# EAGLE design Adafruit Infrared IR Remote Receiver (EAGLE 9.6.2)
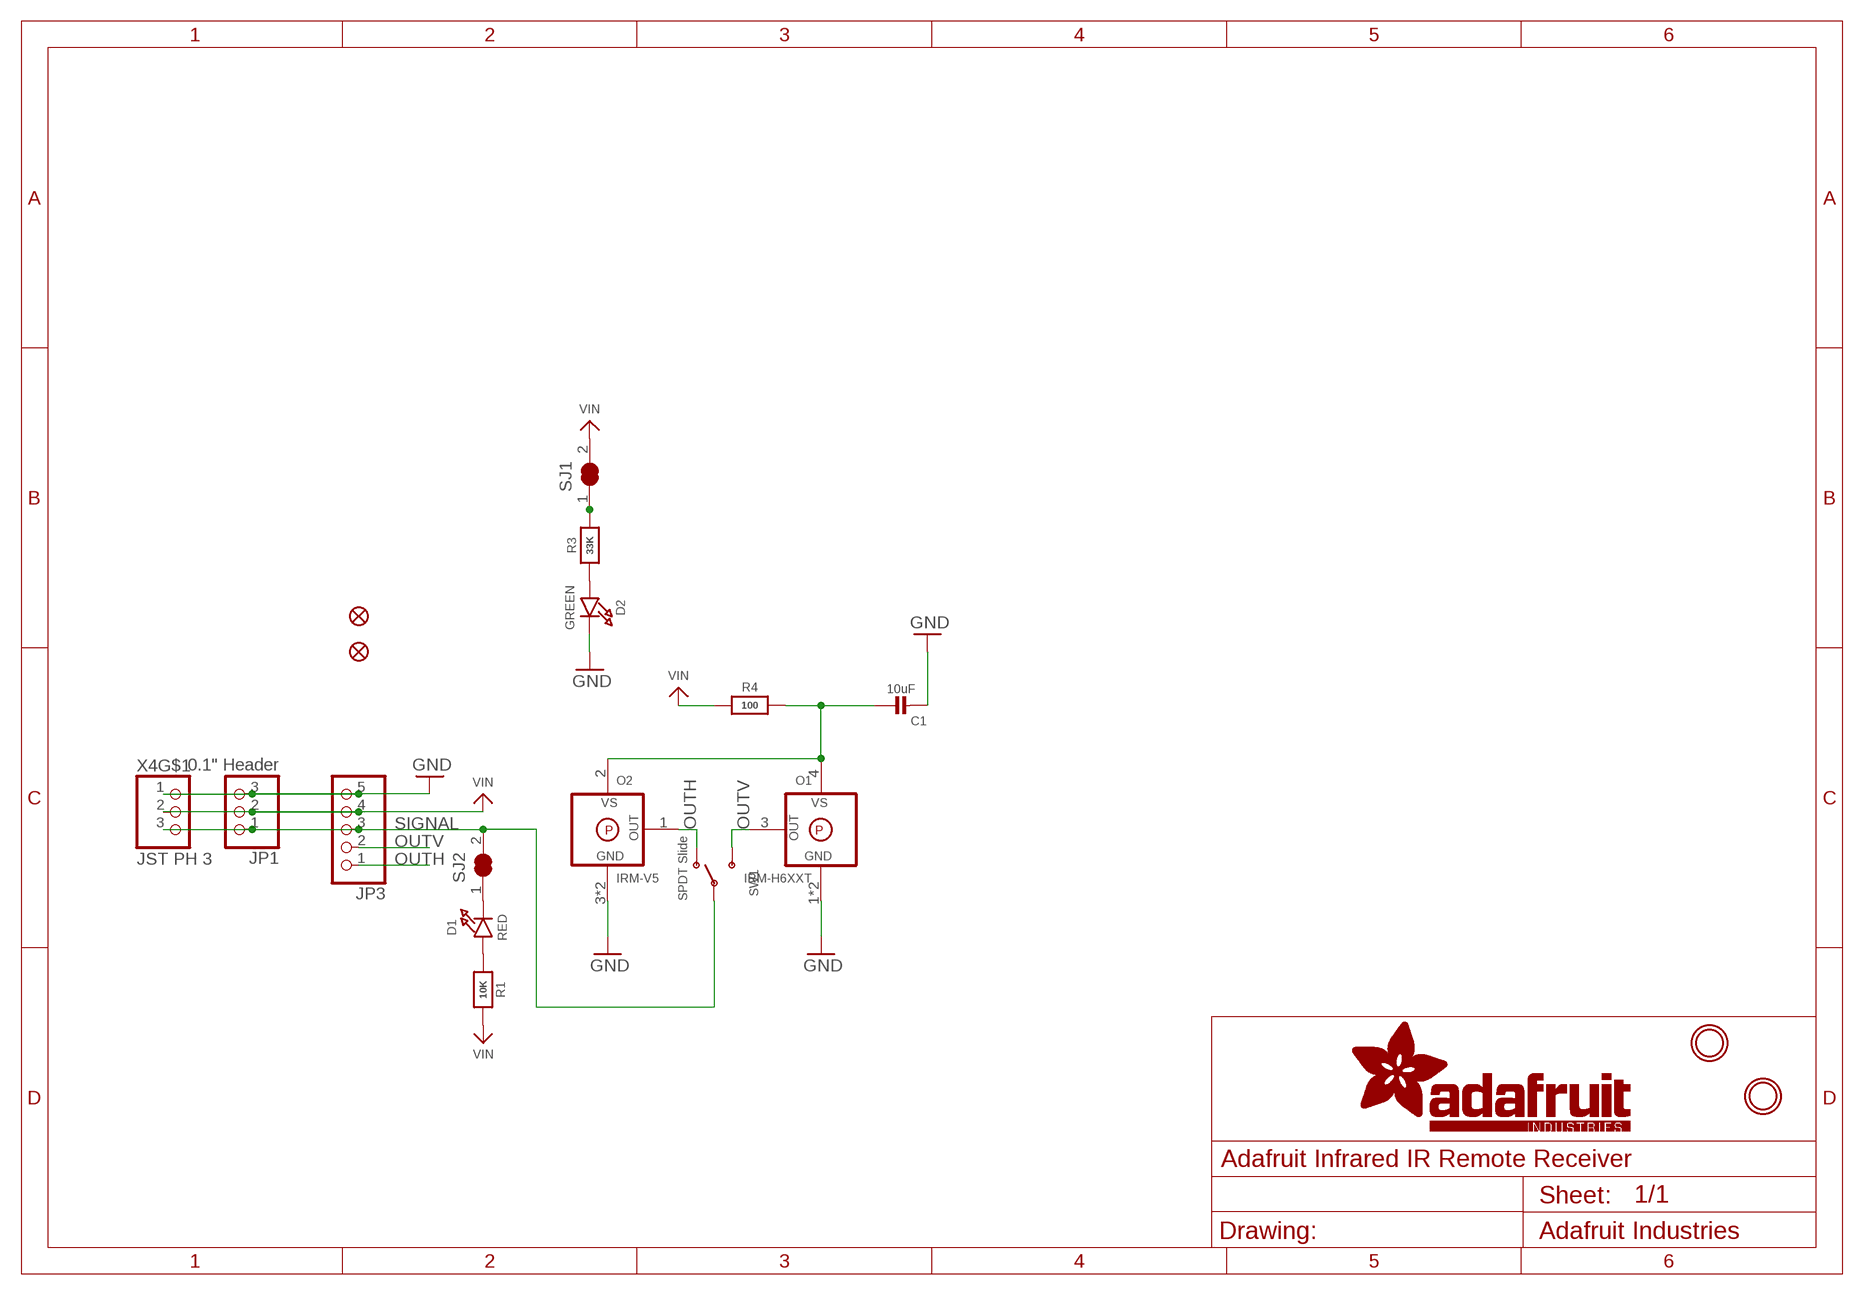
[diagram p0: schematic, sheet 1]

## Parts
C1  10uF  CAP_CERAMIC0805-NOOUTLINE  [0805-NO]
D1  RED  LED0603_NOOUTLINE  [CHIPLED_0603_NOOUTLINE]
D2  GREEN  LED0603_NOOUTLINE  [CHIPLED_0603_NOOUTLINE]
FID2  FIDUCIAL_1MM  [FIDUCIAL_1MM]
FID3  FIDUCIAL_1MM  [FIDUCIAL_1MM]
JP1  0.1" Header  HEADER-1X3  [1X03_OVAL]
JP3  HEADER-1X570MIL  [1X05_ROUND_70]
O1  IRM-H6XXT  GENERIC_IR_RECV_IRM-H6XXT  [IRM-H6XXT]
O2  IRM-V5  GENERIC_IR_RECV_IRM-V5  [IRM-V5]
R1  10K  RESISTOR_0603_NOOUT  [0603-NO]
R3  33K  RESISTOR_0603_NOOUT  [0603-NO]
R4  100  RESISTOR_0603_NOOUT  [0603-NO]
SJ1  SOLDERJUMPER_CLOSED  [SOLDERJUMPER_CLOSEDWIRE]
SJ2  SOLDERJUMPER_CLOSED  [SOLDERJUMPER_CLOSEDWIRE]
SW1  SPDT Slide  SWITCH_SPDT  [SPDT_SMT_SSSS811101]
U$1  MOUNTINGHOLE2.5  [MOUNTINGHOLE_2.5_PLATED]
U$8  MOUNTINGHOLE2.5  [MOUNTINGHOLE_2.5_PLATED]
X4  JST PH 3  CON_JST_PH_3PIN  [JSTPH3]

## Nets
GND: C1.2 D2.C JP1.3 JP3.5 O1.1(GND) O1.2(GND) O2.3(GND) O2.MT(GND) X4.1
N$1: R3.2 SJ1.1
N$2: D1.A R1.1
N$3: D1.C SJ2.1
N$4: C1.1 O1.4(VS) O2.2(VS) R4.2
N$26: D2.A R3.1
OUTH: JP3.1 O2.1(OUT) SW1.A(O)
OUTV: JP3.2 O1.3(OUT) SW1.C(S)
SIGNAL: JP1.1 JP3.3 SJ2.2 SW1.B(P) X4.3
VIN: JP1.2 JP3.4 R1.2 R4.1 SJ1.2 X4.2
Unconnected: X4.NC1(MT) X4.NC2(MT)

## Library data of the parts
C1 = microbuilder:CAP_CERAMIC: Ceramic Capacitors For new designs, use the packages preceded by an '_' character since they are more reliable: The following footprints should be used on most boards: _0402 - Standard footprint for regular board layouts _0603 - Standard footprint for regular board layouts _0805 - Standard footprint for regular board layouts _1206 - Standard footprint for regular board layouts For extremely tight-pitch boards where space is at a premium, the following 'micro-pitch' footprints can be used (smaller pads, no silkscreen outline, etc.): _0402MP - Micro-pitch footprint for very dense/compact boards _0603MP - Micro-pitch footprint for very dense/compact boards _0805MP - Micro-pitch footprint for very dense/compact boards _1206MP - Micro-pitch footprint for very dense/compact boards
D1 D2 = microbuilder:LED: LED 0603 - 0603 Surface Mount Package 2mA: Green LED - Low Power (3.9mcd, 2ma, 1.7Vf) - Digikey: 475-2709-2-ND Orange LED - Low Power (9.8mcd, 2ma, 1.8Vf) - Digikey: 475-1194-2-ND Red LED - Low Power (5mcd, 2ma, 1.8Vf) - Digikey: 475-1195-2-ND Yellow LED - Low Power (7mcd, 2ma, 1.8Vf) - Digikey: 475-1196-2-ND 5mA: Blue LED - Low Power (17mcd, 5ma, 2.9Vf) - Digikey: LNJ937W8CRACT-ND 0805 - 0805 Surface Mount Package 2mA: Red LED (8.8mcd, 2mA, 1.8Vf, Clear) - Low Power [Digikey: 475-2510-1-ND] Green LED (5mcd, 2mA, 1.8Vf, Clear) - Low Power [Digikey: 475-2730-1-ND] Yellow LED (11.3mcd, 2mA, 1.8Vf, Clear) - Low Power [Digikey: 475-2555-1-ND] 20mA: Red LED (104mcd, 20mA, Diffused) - LS R976 [Digikey: 475-1278-6-ND] Red LED (12mcd, 20mA, 2.0Vf, Clear) - APT2012EC [Digikey: 754-1128-1-ND] Green LED (15mcd, 20mA, 2.2Vf, Clear) - APT2012GC [Digikey: 754-1131-1-ND] Orange LED (160mcd, 20mA, 2.1Vf, Clear) - APT2012SECK [Digikey: 754-1130-1-ND] 1206 - 1206 Surface Mount Package Green LED (26mcd, 20mA, Diffused) - LG N971 [Digikey: 475-1407-6-ND] Red LED (15mcd, 20mA, Diffused) - LH N974 [Digikey: 475-1416-6-ND] Cree - Cree High-Power Surface Mount LEDs XPEBWT-L1-0000-00D50 - White 111lm 350mA 2.9Vf 6200K 110° XTEAWT-00-0000-00000LEE3 - White 114lm 350mA 2.85Vf 5000K 115° Everlight - Everlight 45-21 Series Surface Mount LEDs 45-21/QK2C-B2832AC2CB2/2T - Warm White 2000mcd 20mA 3.25Vf 3050K 120° 45-21/LK2C-B38452C4CB2/2T - Nuetral White 2000mcd 20mA 3.25Vf 4150K 120° 45-21/LK2C-B50634C6CB2/2T - Cold White 2200mcd 20mA 3.25Vf 5650K 120° PLCC2 Reverse Mount LS T77K-J1L2-1-0-2-R18-Z - Red 11.25mcd 2mA 1.8Vf 630nm 120° LO T77K-L1M2-24-Z - Orange 19.6mcd 2mA 1.8Vf 606nm 120° LY T77K-K2M1-26-Z - Yellow 15.7mcd 2mA 1.8Vf 587nm 120°; ROT: 270
FID2 FID3 = microbuilder:FIDUCIAL: Fiducial Alignment Points Various fiducial points for machine vision alignment.; BOM: EXCLUDE
JP1 = microbuilder:HEADER-1X3: PIN HEADER
JP3 = microbuilder:HEADER-1X5: PIN HEADER
O1 O2 = adafruit_sensor:GENERIC_IR_RECV
R1 R3 R4 = microbuilder:RESISTOR: Resistors For new designs, use the packages preceded by an '_' character since they are more reliable: The following footprints should be used on most boards: _0402 - Standard footprint for regular board layouts _0603 - Standard footprint for regular board layouts _0805 - Standard footprint for regular board layouts _1206 - Standard footprint for regular board layouts For extremely tight-pitch boards where space is at a premium, the following 'micro-pitch' footprints can be used (smaller pads, no silkscreen outline, etc.): _0402MP - Micro-pitch footprint for very dense/compact boards _0603MP - Micro-pitch footprint for very dense/compact boards _0805MP - Micro-pitch footprint for very dense/compact boards _1206MP - Micro-pitch footprint for very dense/compact boards
SJ1 SJ2 = microbuilder:SOLDERJUMPER_CLOSED: Solder Jumper - Closed These solder jumpers are closed by default CLOSEDWIRE - 10 mil trace between pads that can be cut and resoldered later CLOSEDPERM - 63 mil trace between pads for a permanent connection (used to 'bridge' two signals, a shameless hack for Eagle). Can double as a test point as well (no cream layer)
SW1 = adafruit_electromech:SWITCH_SPDT: Switch - SPDT SSSS811101 - Horizontal Two Position SMT, 0.3A 4V [Mouser: 688-SSSS811101]
U$1 U$8 = adafruit_electromech:MOUNTINGHOLE: Mounting Hole For #2 screws (0.086"/2.18mm width, 0.094"/2.4mm hole) use 2.5mm; BOM: EXCLUDE
X4 = adafruit_electromech:CON_JST_PH_3PIN

## Net classes
1 HV: width 0.406 mm, drill 0.381 mm, clearance 0.762 mm

## Board
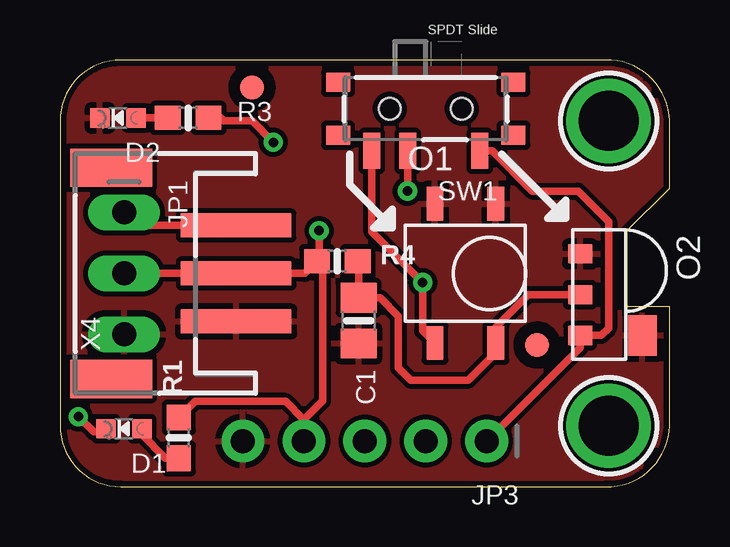
[diagram p1: board, top side]
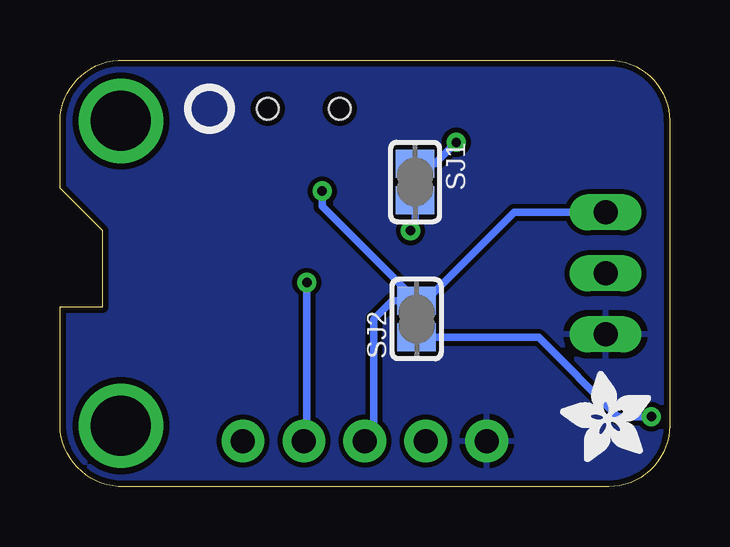
[diagram p2: board, bottom side, seen from below]

Size 25.4 x 17.78 mm. Coordinates in mm from the lower left corner, seen from the top.
Outline: 0,15.24 0,2.54 arc90 2.54,0 22.73,0 arc90 25.4,2.54 25.4,7.49 23.62,7.49 23.62,10.67 25.4,12.45 25.4,15.24 arc90 22.73,17.78 2.54,17.78 arc90 0,15.24
Copper layers (1*16): Top 0.035mm / dielectric 1.5mm / Bottom 0.035mm
Design rules "adafruit": minimum track width 8mil, minimum drill 15.5mil, track to track 8mil, track to pad 8mil, pad to pad 8mil, via to via 8mil, smd to smd 8mil, copper to edge 10mil, drill to drill 8mil, minimum pad ring 10mil, minimum via ring 8mil, stop-mask expansion 2mil, vias tented up to drill 20mil, thermal gap 10mil

### Footprints (pad centres in the part's own frame; a part is rotated, then mirrored left to right if it is on the bottom)
0805-NO = smd 1.24 x 1.5: 1 -0.95,0; 2 0.95,0
CHIPLED_0603_NOOUTLINE = smd 0.8 x 0.8: A 0,-0.75; C 0,0.75
FIDUCIAL_1MM = smd 1 x 1: 1 0,0
1X03_OVAL = drill 1 long: 1 -2.54,0; 2 0,0; 3 2.54,0
1X05_ROUND_70 = drill 1 pad 1.778: 1 -5.08,0; 2 -2.54,0; 3 0,0; 4 2.54,0; 5 5.08,0
IRM-H6XXT = smd 0.7 x 1.4: 1 1.27,2.9; 2 -1.27,2.9; 3 -1.27,-2.9; 4 1.27,-2.9
IRM-V5 = smd 0.8 x 1: 1 1.7,-1.7; 2 0,-1.7; 3 -1.7,-1.7 | smd 1.7 x 1.2: MT 1.7,0.9
0603-NO = smd 1.075 x 1: 1 -0.85,0; 2 0.85,0
SOLDERJUMPER_CLOSEDWIRE = smd 1.168 x 1.6: 1 -0.762,0; 2 0.762,0 | smd 0.635 x 0.203: WIRE 0,0
SPDT_SMT_SSSS811101 = smd 0.7 x 1.5: A -2.25,1.242; B 0.75,1.242; C 2.25,1.242 | smd 1 x 0.8: SUP1 -3.65,0.592; SUP2 -3.65,-1.608; SUP3 3.65,0.592; SUP4 3.65,-1.608 | hole 0.9: -1.5,-0.508; 1.5,-0.508
MOUNTINGHOLE_2.5_PLATED = drill 2.5 pad 3.2: P$1 0,0
JSTPH3 = smd 1 x 4.6: 1 -2,-2.7; 2 0,-2.7; 3 2,-2.7 | smd 1.6 x 3.4: NC1 -4.4,2.5; NC2 4.4,2.5

### Placement (x,y rotation side)
C1  12.45,6.92 270 top
D1  2.67,2.41 90 top
D2  2.41,15.37 90 top
FID2  8,16.64 0 top
FID3  19.88,5.91 0 top
JP1  2.67,8.89 270 top
JP3  12.7,1.91 180 top
O1  16.89,8.89 0 top
O2  23.37,8 270 top
PLABEL0  [PLABEL0]  1.14,16.13 0 top
PLABEL1  [PLABEL1]  1.4,0.64 0 top
PLABEL2  [PLABEL14]  4.32,6.35 0 bottom
PLABEL3  [PLABEL13]  4.45,9.02 0 bottom
PLABEL5  [PLABEL5]  7.11,11.18 0 bottom
PLABEL13  [PLABEL13]  8.89,3.56 0 bottom
PLABEL14  [PLABEL14]  5.21,3.56 0 bottom
PLABEL15  [PLABEL15]  8.51,3.56 0 top
PLABEL16  [PLABEL16]  10.16,16.76 0 top
PLABEL17  [PLABEL17]  20.19,16.89 0 top
PLABEL18  [PLABEL18]  12.7,3.68 0 bottom
PLABEL19  [PLABEL19]  15.24,3.68 0 bottom
PLABEL20  [PLABEL20]  18.03,3.68 0 bottom
PLABEL21  [PLABEL21]  8.76,12.7 90 bottom
PLABEL22  [PLABEL22]  8.76,6.99 90 bottom
PLABEL23  [PLABEL23]  17.4,9.78 90 bottom
PLABEL24  [PLABEL24]  6.6,16.26 0 bottom
R1  4.95,2.03 90 top
R3  5.33,15.37 0 top
R4  11.56,9.4 0 top
SJ1  10.6,12.7 270 bottom
SJ2  10.54,6.99 90 bottom
SW1  15.24,15.24 180 top
U$1  22.86,2.54 0 top
U$5  [PCBFEAT-REV-040]  19.18,15.75 90 bottom
U$8  22.86,15.24 0 top
U$10  [ADAFRUIT_3.5MM]  0.76,1.02 90 bottom
X4  4.64,8.89 90 top

### Tracks (layer width: path | path; a pad name or v marks a point on that pad's centre or on a via)
GND
  pour Top: 0,17.78 25.4,17.78 25.4,0 0,0
  pour Bottom: 0,17.78 25.4,17.78 25.4,0 0,0
N$1  (via drill 0.39)
  Top 0.305: v8.89,14.35 8,15.24 6.82,15.24 6.69,15.37 R3.2
  Bottom 0.305: v8.89,14.35 9.78,13.46 SJ1.1
N$2
  Top 0.305: D1.A 3.42,2.16 4.39,1.18 R1.1
N$3  (via drill 0.39)
  Top 0.305: v0.76,2.92 1.4,2.29 1.79,2.29 D1.C
  Bottom 0.305: SJ2.1 5.46,6.22 2.16,2.92 v0.76,2.92
N$4
  Top 0.305: O2.2 19.51,8 18.16,6.65 O1.4 18.16,5.59 17.02,4.45 14.61,4.45 14.1,4.95 14.1,7.11 13.34,7.87 C1.1 12.45,9.36 R4.2
N$26
  Top 0.305: R3.1 D2.A
OUTH
  Top 0.305: SW1.A 18.01,14 19.68,12.32 21.59,12.32 22.86,11.05 22.86,6.6 22.56,6.3 O2.1 21.67,5.79 JP3.1
OUTV  (via drill 0.39)
  Top 0.305: O1.3 15.11,6.5 v15.11,8.51 12.99,10.63 SW1.C
  Bottom 0.305: v15.11,8.51 15.11,2.03 JP3.2
SIGNAL  (via drill 0.39)
  Top 0.305: X4.3 3.21,10.89 JP1.1 | SW1.B v14.49,12.33 v14.48,12.32
  Bottom 0.305: SJ2.2 10.16,7.75 6.48,11.43 JP1.1 | SJ2.2 11.56,7.75 12.32,6.99 12.32,2.29 JP3.3 | v14.48,12.32 14.48,11.68 SJ2.2
VIN  (via drill 0.39)
  Top 0.305: R4.1 10.79,9.49 v10.79,10.67 | R4.1 10.94,9.63 10.94,3.58 10.16,2.79 | R4.1 10.2,8.89 X4.2 JP1.2 | R1.2 5.63,3.56 9.4,3.56 10.16,2.79 | JP3.4 10.16,2.79
  Bottom 0.305: SJ1.2 10.6,10.99 10.79,10.79 v10.79,10.67

### Text on the board
Pinguin_tBackup: V | H | ON | Signal High / To Send | 38KHz IR Recv | 940nm Infrared / LED Emitters | Sig
Pinguin_bBackup: Logic/Power: 3~5VDC | V+:3~5VDC | 100mA+ Current/LED | LED | In | On | 38KHz / Infrared / Remote / Decoding / Receiver | V+ | SIG | GND | Sig | Optional / 5mm LED | Sig | IRV | IRH | In | V+ | GND